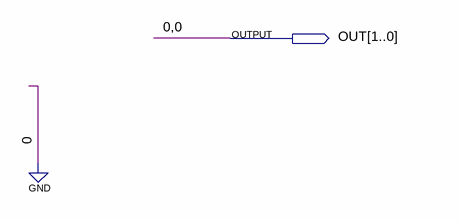
[diagram p0: schematic sheet]
// Quartus schematic ZERO2.bdf as structural Verilog: 0 symbols, 1 pins
module ZERO2 (
  output [1:0] OUT
);


  assign OUT = 2'b00;
endmodule
